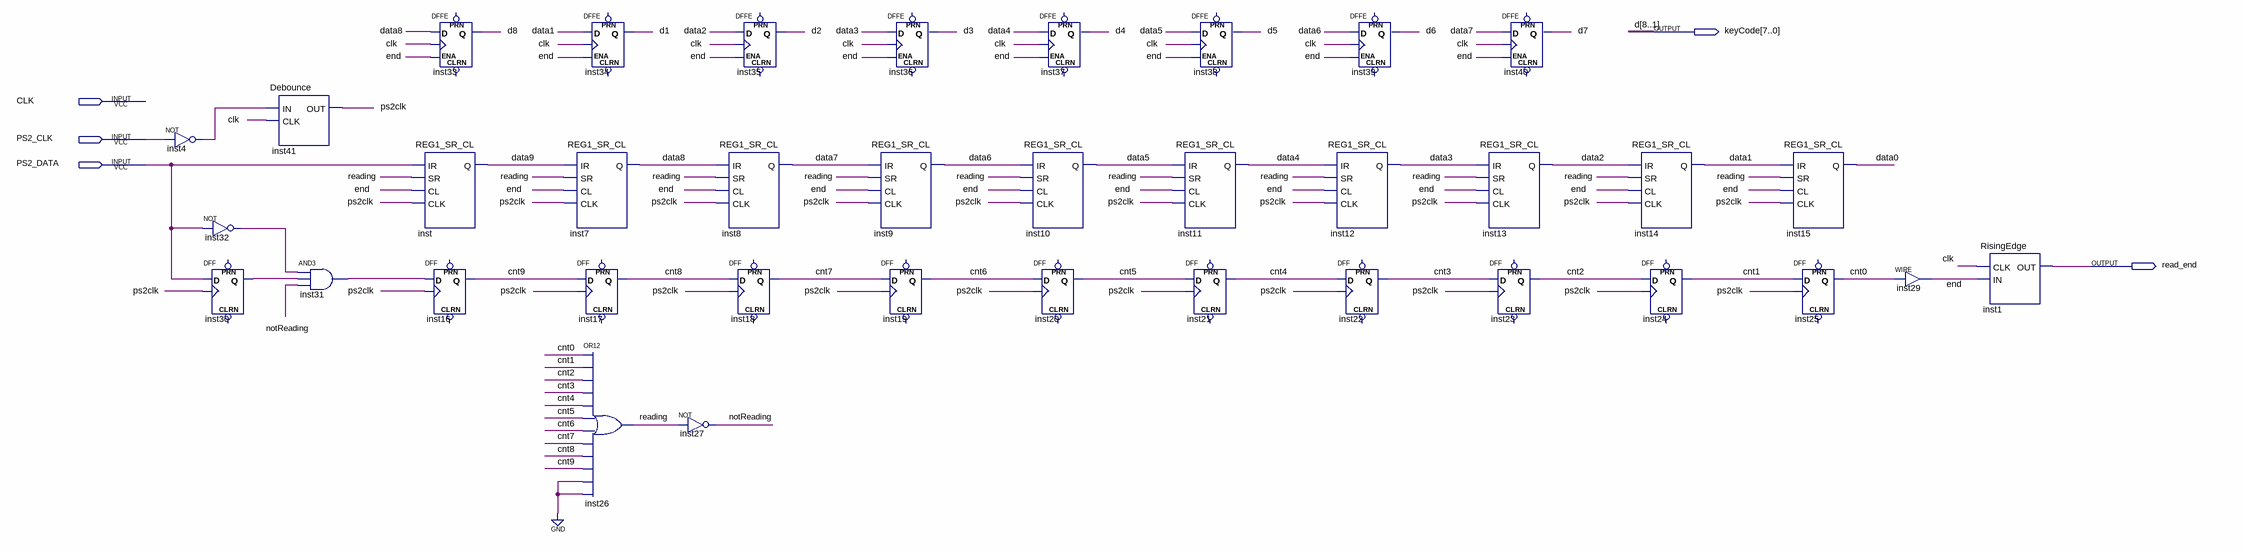
[diagram p0: schematic sheet]
// Quartus schematic KEY_INTERFACE.bdf as structural Verilog: 37 symbols, 5 pins
module KEY_INTERFACE (
  input  CLK,
  input  PS2_CLK,
  input  PS2_DATA,
  output [7:0] keyCode,
  output read_end
);

  wire cnt0, cnt1, cnt2, cnt3, cnt4, cnt5, cnt6, cnt7, cnt8, cnt9, data0, data1, data2, data3, data4, data5,
       data6, data7, data8, data9, \end , inst4_out, inst30_q, inst31_out, inst32_out, notReading, ps2clk,
       reading;

  not inst4 (inst4_out, PS2_CLK);
  not inst32 (inst32_out, PS2_DATA);
  DFF inst30 (.CLK(ps2clk), .D(PS2_DATA), .Q(inst30_q));  // open: CLRN, PRN
  Debounce inst41 (.IN(inst4_out), .CLK(CLK), .OUT(ps2clk));
  and inst31 (inst31_out, inst32_out, inst30_q, notReading);
  DFFE inst33 (.D(data8), .CLK(CLK), .ENA(\end ), .Q(keyCode[7]));  // open: PRN, CLRN
  REG1_SR_CL inst (.IR(PS2_DATA), .SR(reading), .CL(\end ), .CLK(ps2clk), .Q(data9));
  DFF inst16 (.CLK(ps2clk), .D(inst31_out), .Q(cnt9));  // open: CLRN, PRN
  DFFE inst34 (.D(data1), .CLK(CLK), .ENA(\end ), .Q(keyCode[0]));  // open: PRN, CLRN
  REG1_SR_CL inst7 (.IR(data9), .SR(reading), .CL(\end ), .CLK(ps2clk), .Q(data8));
  DFF inst17 (.CLK(ps2clk), .D(cnt9), .Q(cnt8));  // open: CLRN, PRN
  or inst26 (reading, cnt0, cnt1, cnt2, cnt3, cnt4, cnt5, cnt6, cnt7, cnt8, cnt9, 1'b0, 1'b0);
  not inst27 (notReading, reading);
  DFFE inst35 (.D(data2), .CLK(CLK), .ENA(\end ), .Q(keyCode[1]));  // open: PRN, CLRN
  REG1_SR_CL inst8 (.IR(data8), .SR(reading), .CL(\end ), .CLK(ps2clk), .Q(data7));
  DFF inst18 (.CLK(ps2clk), .D(cnt8), .Q(cnt7));  // open: CLRN, PRN
  DFFE inst36 (.D(data3), .CLK(CLK), .ENA(\end ), .Q(keyCode[2]));  // open: PRN, CLRN
  REG1_SR_CL inst9 (.IR(data7), .SR(reading), .CL(\end ), .CLK(ps2clk), .Q(data6));
  DFF inst19 (.CLK(ps2clk), .D(cnt7), .Q(cnt6));  // open: CLRN, PRN
  DFFE inst37 (.D(data4), .CLK(CLK), .ENA(\end ), .Q(keyCode[3]));  // open: PRN, CLRN
  REG1_SR_CL inst10 (.IR(data6), .SR(reading), .CL(\end ), .CLK(ps2clk), .Q(data5));
  DFF inst20 (.CLK(ps2clk), .D(cnt6), .Q(cnt5));  // open: CLRN, PRN
  DFFE inst38 (.D(data5), .CLK(CLK), .ENA(\end ), .Q(keyCode[4]));  // open: PRN, CLRN
  REG1_SR_CL inst11 (.IR(data5), .SR(reading), .CL(\end ), .CLK(ps2clk), .Q(data4));
  DFF inst21 (.CLK(ps2clk), .D(cnt5), .Q(cnt4));  // open: CLRN, PRN
  DFFE inst39 (.D(data6), .CLK(CLK), .ENA(\end ), .Q(keyCode[5]));  // open: PRN, CLRN
  REG1_SR_CL inst12 (.IR(data4), .SR(reading), .CL(\end ), .CLK(ps2clk), .Q(data3));
  DFF inst22 (.CLK(ps2clk), .D(cnt4), .Q(cnt3));  // open: CLRN, PRN
  DFFE inst40 (.D(data7), .CLK(CLK), .ENA(\end ), .Q(keyCode[6]));  // open: PRN, CLRN
  REG1_SR_CL inst13 (.IR(data3), .SR(reading), .CL(\end ), .CLK(ps2clk), .Q(data2));
  DFF inst23 (.CLK(ps2clk), .D(cnt3), .Q(cnt2));  // open: CLRN, PRN
  REG1_SR_CL inst14 (.IR(data2), .SR(reading), .CL(\end ), .CLK(ps2clk), .Q(data1));
  DFF inst24 (.CLK(ps2clk), .D(cnt2), .Q(cnt1));  // open: CLRN, PRN
  REG1_SR_CL inst15 (.IR(data1), .SR(reading), .CL(\end ), .CLK(ps2clk), .Q(data0));
  DFF inst25 (.CLK(ps2clk), .D(cnt1), .Q(cnt0));  // open: CLRN, PRN
  assign \end  = cnt0;  // WIRE inst29
  RisingEdge inst1 (.CLK(CLK), .IN(\end ), .OUT(read_end));

  // Other names for the same wires on the sheet: d[8:1] = keyCode; d1 = keyCode[0]; d2 = keyCode[1]; d3 = keyCode[2];
  //   d4 = keyCode[3]; d5 = keyCode[4]; d6 = keyCode[5]; d7 = keyCode[6]; d8 = keyCode[7]
endmodule
